# EAGLE schematic SWARMESH (EAGLE 9.2.0)
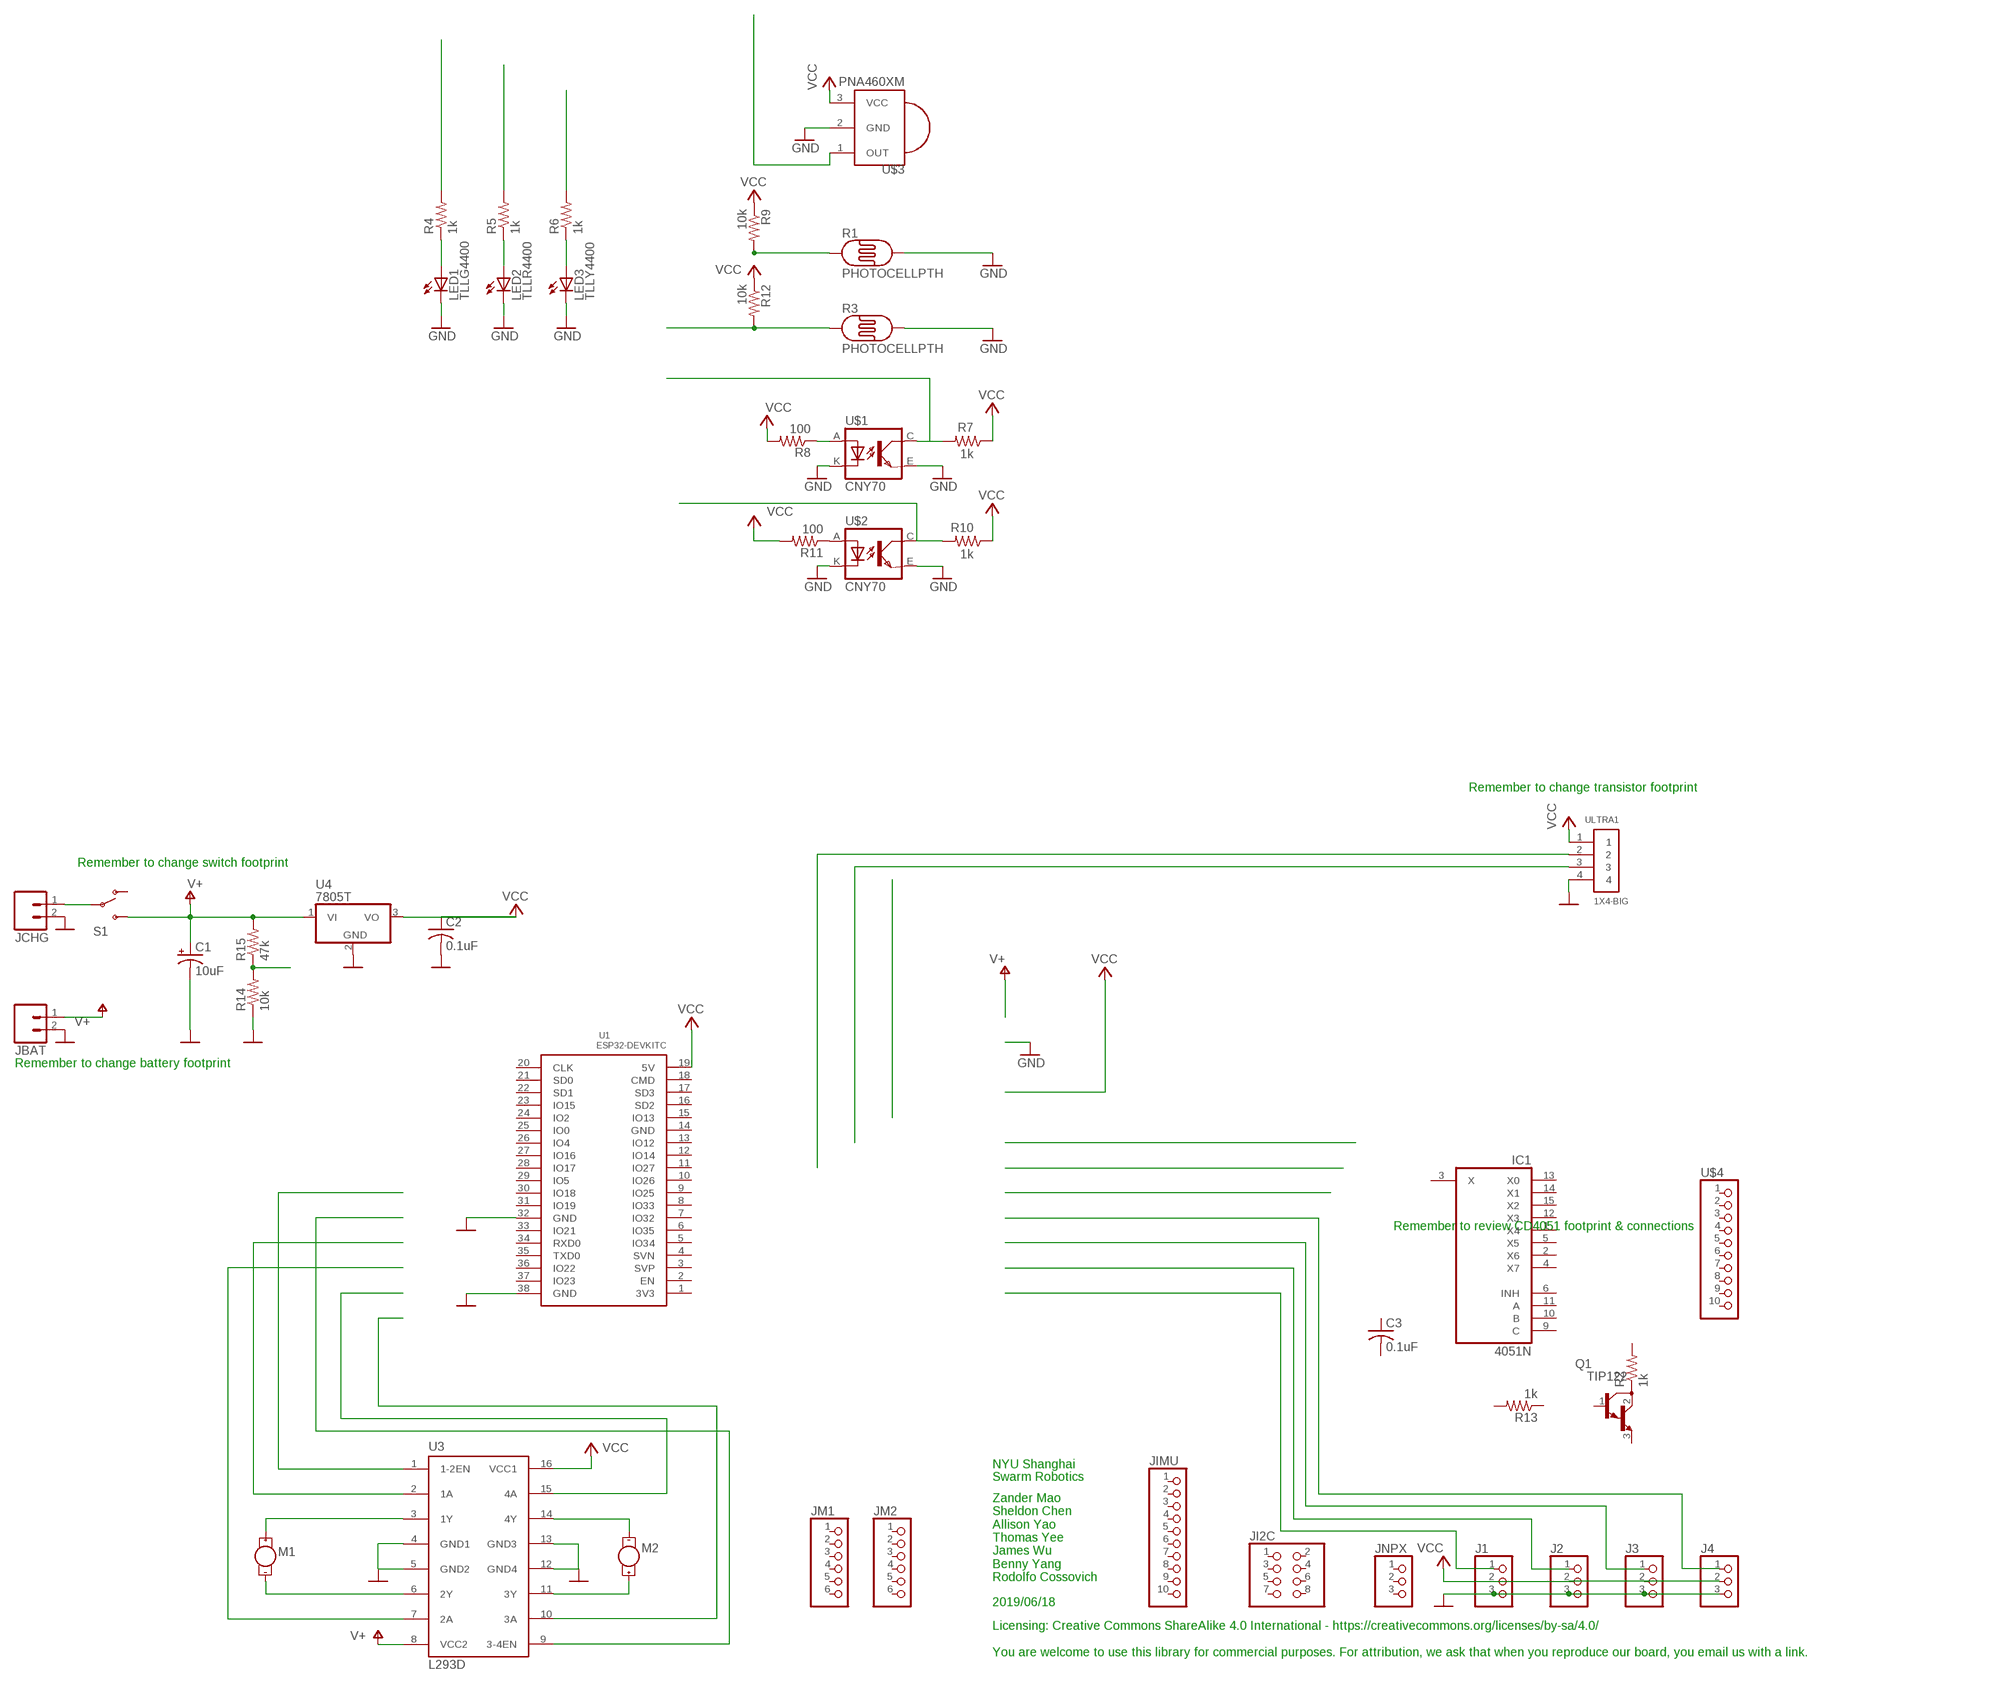
[diagram p0: schematic, sheet 1]

## Parts
C1  10uF  CPOL-USE10-20  [EB20D]
C2  0.1uF  C-US050-024X044  [C050-024X044]
C3  0.1uF  C-US050-024X044  [C050-024X044]
IC1  4051N  [DIL16]
J1  PINHD-1X3  [1X03]
J2  PINHD-1X3  [1X03]
J3  PINHD-1X3  [1X03]
J4  PINHD-1X3  [1X03]
JBAT  M02-JST-2-PTH-NO_SILK  [JST-2-PTH-NS]
JCHG  M02-JST-2-PTH-NO_SILK  [JST-2-PTH-NS]
JI2C  PINHD-2X4  [2X04]
JIMU  PINHD-1X10  [1X10-BIG]
JM1  PINHD-1X6  [1X06]
JM2  PINHD-1X6  [1X06]
JNPX  PINHD-1X3  [1X03]
LED1  TLLG4400  [LED3MM]
LED2  TLLR4400  [LED3MM]
LED3  TLLY4400  [LED3MM]
M1  MOTOR10MM  [VIBE-MOTOR-10MM]
M2  MOTOR10MM  [VIBE-MOTOR-10MM]
Q1  TIP122  [TO220]
R1  PHOTOCELLPTH  [PHOTOCELL]
R2  1k  R-US_0207/12  [0207/12]
R3  PHOTOCELLPTH  [PHOTOCELL]
R4  1k  R-US_0207/12  [0207/12]
R5  1k  R-US_0207/12  [0207/12]
R6  1k  R-US_0207/12  [0207/12]
R7  1k  R-US_0207/12  [0207/12]
R8  100  R-US_0207/12  [0207/12]
R9  10k  R-US_0207/12  [0207/12]
R10  1k  R-US_0207/12  [0207/12]
R11  100  R-US_0207/12  [0207/12]
R12  10k  R-US_0207/12  [0207/12]
R13  1k  R-US_0207/12  [0207/12]
R14  10k  R-US_0207/12  [0207/12]
R15  47k  R-US_0207/12  [0207/12]
S1  SWITCH-SPDTPTH2  [SWITCHE-DPDT]
U1  ESP32DEVKITC  [ESP32-DEVKITC]
U3  L293D  [DIL16]
U4  7805T  [TO220H]
U$1  CNY70  [4]
U$2  CNY70  [4]
U$3  PNA460XM  [PNA460XM]
U$4  PINHD-1X10  [1X10-BIG]
ULTRA1  1X4-BIG  [1X04-BIG]

## Nets
GND: C1.- C2.2 J1.3 J2.3 J3.3 J4.3 JBAT.2 JCHG.2 LED1.K(C) LED2.K(C) LED3.K(C) R1.2 R3.2 R14.1 U1.32(GND) U1.38(GND) U3.4(GND1) U3.5(GND2) U3.12(GND4) U3.13(GND3) U4.2(GND) U$1.E(EMI) U$1.K(C) U$2.E(EMI) U$2.K(C) U$3.2(GND) ULTRA1.4
N$1: LED1.A R4.1
N$2: LED2.A R5.1
N$3: LED3.A R6.1
N$4: U3.2(1A)
N$5: U3.7(2A)
N$6: U3.15(4A)
N$7: U3.10(3A)
N$8: U3.1(1-2EN)
N$9: U3.9(3-4EN)
N$10: M1.+ U3.3(1Y)
N$11: M1.- U3.6(2Y)
N$12: M2.- U3.14(4Y)
N$13: M2.+ U3.11(3Y)
N$14: R4.2
N$15: R5.2
N$16: R6.2
N$18: R7.2 U$1.C(COL)
N$19: R11.1 U$2.A
N$20: U$3.1(OUT)
N$21: JCHG.1 S1.2(P)
N$22: R8.1 U$1.A
N$23: J1.1
N$24: R1.1 R9.2
N$26: R10.2 U$2.C(COL)
N$27: ULTRA1.2
N$28: ULTRA1.3
N$29: J2.1
N$30: J3.1
N$31: J4.1
N$32: R14.2 R15.1
N$35: R3.1 R12.2
N$37: Q1.2(C) R2.1
N$38: R15.2
V+: C1.+ JBAT.1 S1.3(S) U3.8(VCC2) U4.1(VI)
VCC: C2.1 J1.2 J2.2 J3.2 J4.2 R7.1 R8.2 R9.1 R10.1 R11.2 R12.1 U1.19(5V) U3.16(VCC1) U4.3(VO) U$3.3(VCC) ULTRA1.1
Unconnected: C3.1 C3.2 IC1.1(X4) IC1.2(X6) IC1.3(X) IC1.4(X7) IC1.5(X5) IC1.6(INH) IC1.9(C) IC1.10(B) IC1.11(A) IC1.12(X3) IC1.13(X0) IC1.14(X1) IC1.15(X2) JI2C.1 JI2C.2 JI2C.3 JI2C.4 JI2C.5 JI2C.6 JI2C.7 JI2C.8 JIMU.1 JIMU.2 JIMU.3 JIMU.4 JIMU.5 JIMU.6 JIMU.7 JIMU.8 JIMU.9 JIMU.10 JM1.1 JM1.2 JM1.3 JM1.4 JM1.5 JM1.6 JM2.1 JM2.2 JM2.3 JM2.4 JM2.5 JM2.6 JNPX.1 JNPX.2 JNPX.3 Q1.1(B) Q1.3(E) R2.2 R13.1 R13.2 S1.1(O) U1.1(3V3) U1.2(EN) U1.3(SVP) U1.4(SVN) U1.5(IO34) U1.6(IO35) U1.7(IO32) U1.8(IO33) U1.9(IO25) U1.10(IO26) U1.11(IO27) U1.12(IO14) U1.13(IO12) U1.14(GND) U1.15(IO13) U1.16(SD2) U1.17(SD3) U1.18(CMD) U1.20(CLK) U1.21(SD0) U1.22(SD1) U1.23(IO15) U1.24(IO2) U1.25(IO0) U1.26(IO4) U1.27(IO16) U1.28(IO17) U1.29(IO5) U1.30(IO18) U1.31(IO19) U1.33(IO21) U1.34(RXD0) U1.35(TXD0) U1.36(IO22) U1.37(IO23) U$4.1 U$4.2 U$4.3 U$4.4 U$4.5 U$4.6 U$4.7 U$4.8 U$4.9 U$4.10

## Notes on the sheet
- Remember to change transistor footprint
- Remember to change switch footprint
- Remember to change battery footprint
- Remember to review CD4051 footprint & connections
- NYU Shanghai
- Swarm Robotics
- Zander Mao
  Sheldon Chen
  Allison Yao
  Thomas Yee
  James Wu
  Benny Yang
  Rodolfo Cossovich
- 2019/06/18
- Licensing: Creative Commons ShareAlike 4.0 International - https://creativecommons.org/licenses/by-sa/4.0/ 
  
  You are welcome to use this library for commercial purposes. For attribution, we ask that when you reproduce our board, you email us with a link.

## Power pins joined to a net without a drawn wire
GND: IC1.8(GND)
VCC: IC1.16(VCC)
VEE: IC1.7(VEE)

## Library data of the parts
C1 = adafruit:CPOL-US: POLARIZED CAPACITOR, American symbol
C2 C3 = adafruit:C-US: CAPACITOR, American symbol
IC1 = 40xx:4051: 8-channel ANALOG MULTIPLEXER
J1-J4 JNPX = adafruit:PINHD-1X3: PIN HEADER
JBAT JCHG = SparkFun-Connectors:M02: Standard 2-pin 0.1" header. Use with - straight break away headers ( PRT-00116) - right angle break away headers (PRT-00553) - swiss pins (PRT-00743) - machine pins (PRT-00117) - female headers (PRT-00115) Molex polarized connector foot print use with: PRT-08233 with associated crimp pins and housings. 2.54_SCREWTERM for use with PRT-10571. 3.5mm Screw Terminal footprints for PRT-08084 5mm Screw Terminal footprints for use with PRT-08432
JI2C = adafruit:PINHD-2X4: PIN HEADER
JIMU U$4 = adafruit:PINHD-1X10: Pin header 1x10 0.1" spacing With round pins
JM1 JM2 = adafruit:PINHD-1X6: PIN HEADER
LED1 = led:TLLG4400: Low Current (2mA) LED 3 mm Tinted Diffused Package color GREEN Source: Data sheet <http://www.farnell.com/datasheets/391098.pdf>; MF: VISHAY SEMICONDUCTOR; OC_FARNELL: 1612435
LED2 = led:TLLR4400: Low Current (2mA) LED 3 mm Tinted Diffused Package color RED Source: Data sheet <http://www.farnell.com/datasheets/391100.pdf>; MF: VISHAY SEMICONDUCTOR; OC_FARNELL: 1612437
LED3 = led:TLLY4400: Low Current (2mA) LED 3 mm Tinted Diffused Package color YELLOW Source: Data sheet <http://www.farnell.com/datasheets/391098.pdf>; MF: VISHAY SEMICONDUCTOR; OC_FARNELL: 1612439
M1 M2 = SparkFun-Electromechanical:MOTOR: Vibration Motor- ROB-08449 Physical dimension and wire connections for this powerful vibration motor. Motor has a self adhesive backing.
Q1 = transistor-npn:TIP122*: NPN Darlington Transistor
R1 R3 = SparkFun-Sensors:PHOTOCELL: CdS photoresistor. This is a low cost way to detect light levels. Resistance decreases with more incoming light. SparkFun SKU: SEN-09088
R2 R4-R15 = adafruit:R-US_: RESISTOR, American symbol
S1 = SparkFun-Electromechanical:SWITCH-SPDT: SPDT Switch Simple slide switch, Spark Fun Electronics SKU : COM-00102 DPDT SMT slide switch, AYZ0202, SWCH-08179
U1 = ESP32-DEVKITC (1):ESP32DEVKITC
U3 = st-microelectronics:L293D: PUSH-PULL 4 CHANNEL DRIVER; MPN: L293D; OC_FARNELL: 9589619; OC_NEWARK: 56P8249
U4 = adafruit:78*: Positive VOLTAGE REGULATOR Added bigger pads to the TO-92 package
U$1 U$2 = cny70:CNY70
U$3 = adafruit:PNA460XM: IR 38KHz receiver PNA4602 and related receivers http://www.ladyada.net/library/pcb/eaglelibrary.html
ULTRA1 = adafruit:1X4: 4-pin connector